# EAGLE schematic battery-charger (EAGLE 9.6.2)
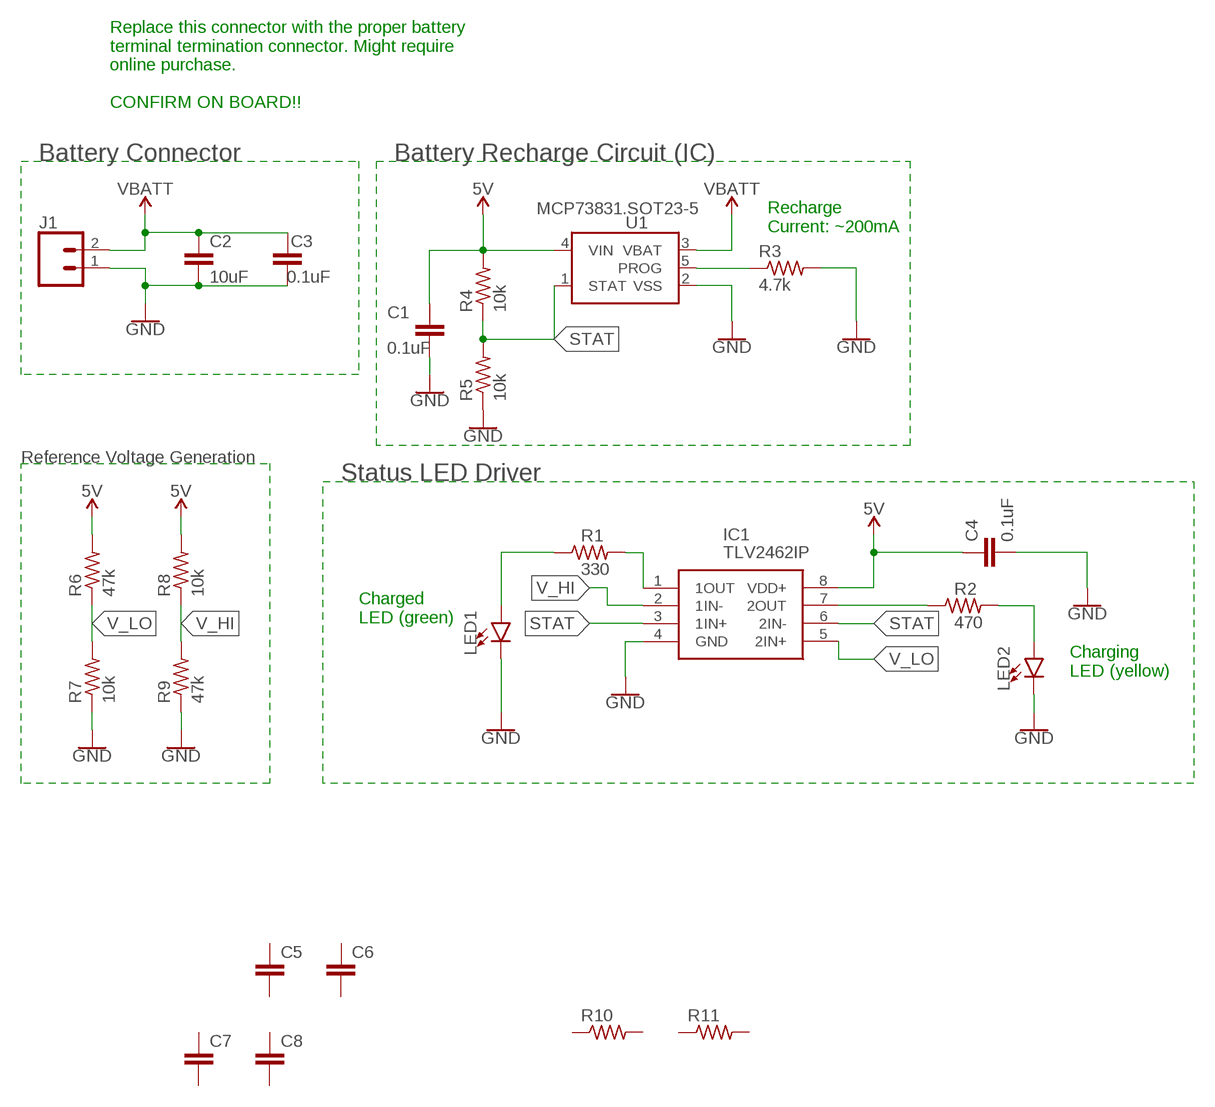
[diagram p0: schematic, sheet 1]

## Parts
C1  0.1uF  CAPACITOR0603  [C0603]
C2  10uF  CAPACITOR0603  [C0603]
C3  0.1uF  CAPACITOR0603  [C0603]
C4  0.1uF  CAPACITOR0603  [C0603]
C5  CAPACITOR0603  [C0603]
C6  CAPACITOR0603  [C0603]
C7  CAPACITOR0603  [C0603]
C8  CAPACITOR0603  [C0603]
IC1  TLV2462IP  [DIP794W53P254L959H508Q8N]
J1  CONN_02PTH3  [1X02_LONGPADS]
LED1  LED0603  [LED-0603]
LED2  LED0603  [LED-0603]
R1  330  RESISTOR0603  [R0603]
R2  470  RESISTOR0603  [R0603]
R3  4.7k  RESISTOR0603  [R0603]
R4  10k  RESISTOR0603  [R0603]
R5  10k  RESISTOR0603  [R0603]
R6  47k  RESISTOR0603  [R0603]
R7  10k  RESISTOR0603  [R0603]
R8  10k  RESISTOR0603  [R0603]
R9  47k  RESISTOR0603  [R0603]
R10  RESISTOR0603  [R0603]
R11  RESISTOR0603  [R0603]
U1  MCP73831.SOT23-5  [SOT23-5]

## Nets
5V: C1.2 C4.1 IC1.8(VDD+) R4.2 R6.2 R8.2 U1.4(VIN)
GND: C1.1 C2.2 C3.2 C4.2 IC1.4(GND) J1.1 LED1.C LED2.C R3.2 R5.1 R7.1 R9.1 U1.2(VSS)
N$1: IC1.1(1OUT) R1.2
N$2: LED1.A R1.1
N$3: IC1.7(2OUT) R2.1
N$4: LED2.A R2.2
N$5: R3.1 U1.5(PROG)
STAT: IC1.3(1IN+) IC1.6(2IN-) R4.1 R5.2 U1.1(STAT)
V_BATT: C2.1 C3.1 J1.2 U1.3(VBAT) ; supply symbol labelled VBATT
V_HI: IC1.2(1IN-) R8.1 R9.2
V_LO: IC1.5(2IN+) R6.1 R7.2
Unconnected: C5.1 C5.2 C6.1 C6.2 C7.1 C7.2 C8.1 C8.2 R10.1 R10.2 R11.1 R11.2

## Notes on the sheet
- Replace this connector with the proper battery
  terminal termination connector. Might require
  online purchase.
  
  CONFIRM ON BOARD!!
- Battery Connector | Battery Recharge Circuit (IC)
- Recharge
  Current: ~200mA
- Reference Voltage Generation
- Status LED Driver
- Charged
  LED (green)
- Charging
  LED (yellow)

## Library data of the parts
C1-C8 = LinnesLab-Passives:CAPACITOR
IC1 = SamacSys_Parts:TLV2462IP: Dual Low-Power, Rail-to-Rail Input/Output Operational Amplifier Source: Datasheet <http://www.ti.com/lit/gpn/tlv2462>; ARROW_PART_NUMBER: TLV2462IP; ARROW_PRICE-STOCK: https://www.arrow.com/en/products/tlv2462ip/texas-instruments; DESCRIPTION: Dual Low-Power, Rail-to-Rail Input/Output Operational Amplifier; HEIGHT: 5.08mm; MANUFACTURER_NAME: Texas Instruments; MANUFACTURER_PART_NUMBER: TLV2462IP; MOUSER_PART_NUMBER: 595-TLV2462IP; MOUSER_PRICE-STOCK: https://www.mouser.co.uk/ProductDetail/Texas-Instruments/TLV2462IP?qs=0le1rQK8zxo1BiHyPl8Tnw%3D%3D
J1 = LinnesLab-Connectors:CONN_02: Multi connection point. Often used as Generic Header-pin footprint for 0.1 inch spaced/style header connections On any of the 0.1 inch spaced packages, you can populate with these: Break Away Headers - Straight <https://www.sparkfun.com/products/116> (PRT-00116) Break Away Male Headers - Right Angle <https://www.sparkfun.com/products/553> (PRT-00553) Female Headers <https://www.sparkfun.com/products/115> (PRT-00115) Break Away Headers - Machine Pin <https://www.sparkfun.com/products/117> (PRT-00117) Break Away Female Headers - Swiss Machine Pin <https://www.sparkfun.com/products/743> (PRT-00743) For SCREWTERMINALS and SPRING TERMINALS visit here: Screw Terimnals on SparkFun.com <https://www.sparkfun.com/search/results?term=Screw+Terminals> (5mm/3.5mm/2.54mm spacing) This device is also useful as a general connection point to wire up your design to another part of your project. Our various solder wires solder well into these plated through hole pads. Hook-Up Wire - Assortment (Stranded, 22 AWG) <https://www.sparkfun.com/products/11375> (PRT-11375) Hook-Up Wire - Assortment (Solid Core, 22 AWG) <https://www.sparkfun.com/products/11367> (PRT-11367) View the entire wire category on our website here <https://www.sparkfun.com/categories/141> Special notes: Molex polarized connector foot print use with: PRT-08233 with associated crimp pins and housings. 2.54_SCREWTERM for use with PRT-10571. 3.5mm Screw Terminal footprints for PRT-08084 5mm Screw Terminal footprints for use with PRT-08432
LED1 LED2 = LinnesLab-LED:LED: LED (Generic) Standard schematic elements and footprints for 5mm, 3mm, 1206, and 0603 sized LEDs. Generic LEDs with no color specified. LTST-C190KGKT: arrow indicates cathode
R1-R11 = LinnesLab-Passives:RESISTOR
U1 = LinnesLab-Power:MCP73831